# Altium project ISPR_DEOP.PrjPcb
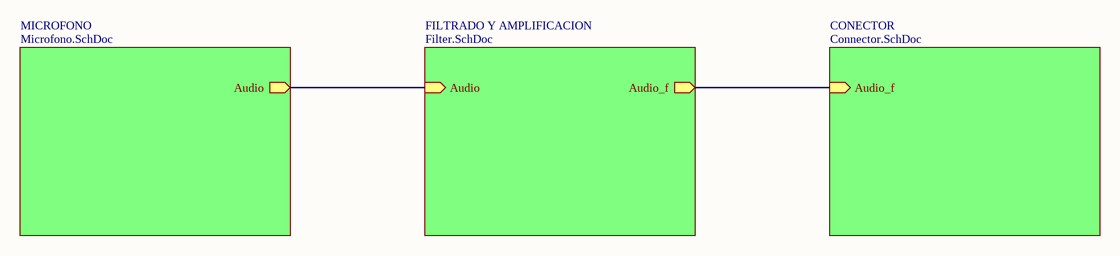
[diagram p0: Main.SchDoc]
3 sheets, 27 parts. Net scope: hierarchical (ports join the sheet entries above them; power ports are global).
Sheets:
  Main.SchDoc
    MICROFONO = Microfono.SchDoc
    FILTRADO Y AMPLIFICACION = Filter.SchDoc

## Sheet Main.SchDoc: PCB_Microfono
size A4; Author: Jose Luis Llorente González; CompanyName: ETSIT; Organization: UPM; Revision: V1.0

### Sub-sheets
CONECTOR = Connector.SchDoc (file not in this document): Audio_f (in)
FILTRADO Y AMPLIFICACION = Filter.SchDoc: Audio (in), Audio_f (out)
MICROFONO = Microfono.SchDoc: Audio (out)

### Nets
Out_E2: sheet FILTRADO Y AMPLIFICACION/Audio_f, sheet CONECTOR/Audio_f
NetC7_1: sheet MICROFONO/Audio, sheet FILTRADO Y AMPLIFICACION/Audio

### Notes on the sheet
- Title
- Size:
- Date:
- A4
- Number:
- Time:
- Revision:
- Sheet
- of
- File:

## Sheet Microfono.SchDoc: Microfono
size A4; Author: Jose Luis Llorente Gonzalez; CompanyName: ETSIT; Organization: UPM; Revision: V1.0
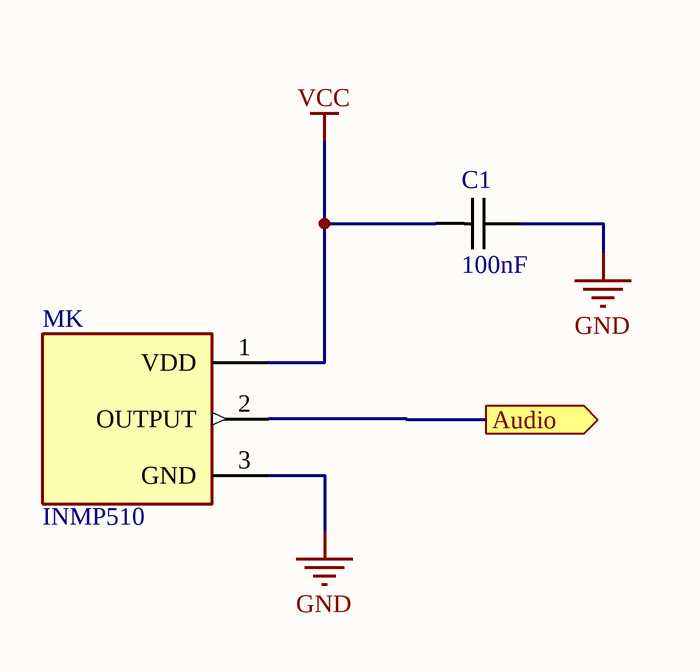
[diagram p1: Microfono.SchDoc]

### Parts
C1  100nF  [0805C-TBD]
MK  INMP510  [XDCR_INMP510]

### Ports
Audio (out)

### Nets
GND: C1.2 MK.3(GND)
VCC: C1.1 MK.1(VDD)
NetC7_1: MK.2(OUTPUT) ; port Audio

### Notes on the sheet
- Title
- Size:
- Date:
- A4
- Number:
- Time:
- Revision:
- Sheet
- of
- File:

### Library data of the parts
C1 = 0805C-100nF-25V-X7R-MUR: CAPACITOR 0805 CERAMIC; Supplier 1: Digi-Key; Supplier Part Number 1: 490-1673-1-ND
MK = INMP510: 60Hz ~ 20kHz Analog Microphone MEMS _Silicon_ 1.5V ~ 3.63V Omnidirectional _-38dB Â±2dB @ 94dB SPL_ Solder Pads; MF: TDK InvenSense; Value: *; MP: INMP510; SnapEDA_Link: https://www.snapeda.com/parts/INMP510/TDK%20InvenSense/view-part/2757133/?ref=snap; Package: LGA-3 TDK-InvenSense; Digi-Key_Part_Number: 1428-1016-2-ND; Digi-Key_Purchase_URL: https://www.digikey.com/product-detail/en/tdk-invensense/INMP510ACEZ-R7/1428-1016-2-ND/4311534?utm_source=snapeda&utm_medium=aggregator&utm_campaign=symbol

## Sheet Filter.SchDoc: Filter & amplification
size A4; Author: Jose Luis Llorente Gonzalez; CompanyName: ETSIT; Organization: UPM; Revision: V1.0
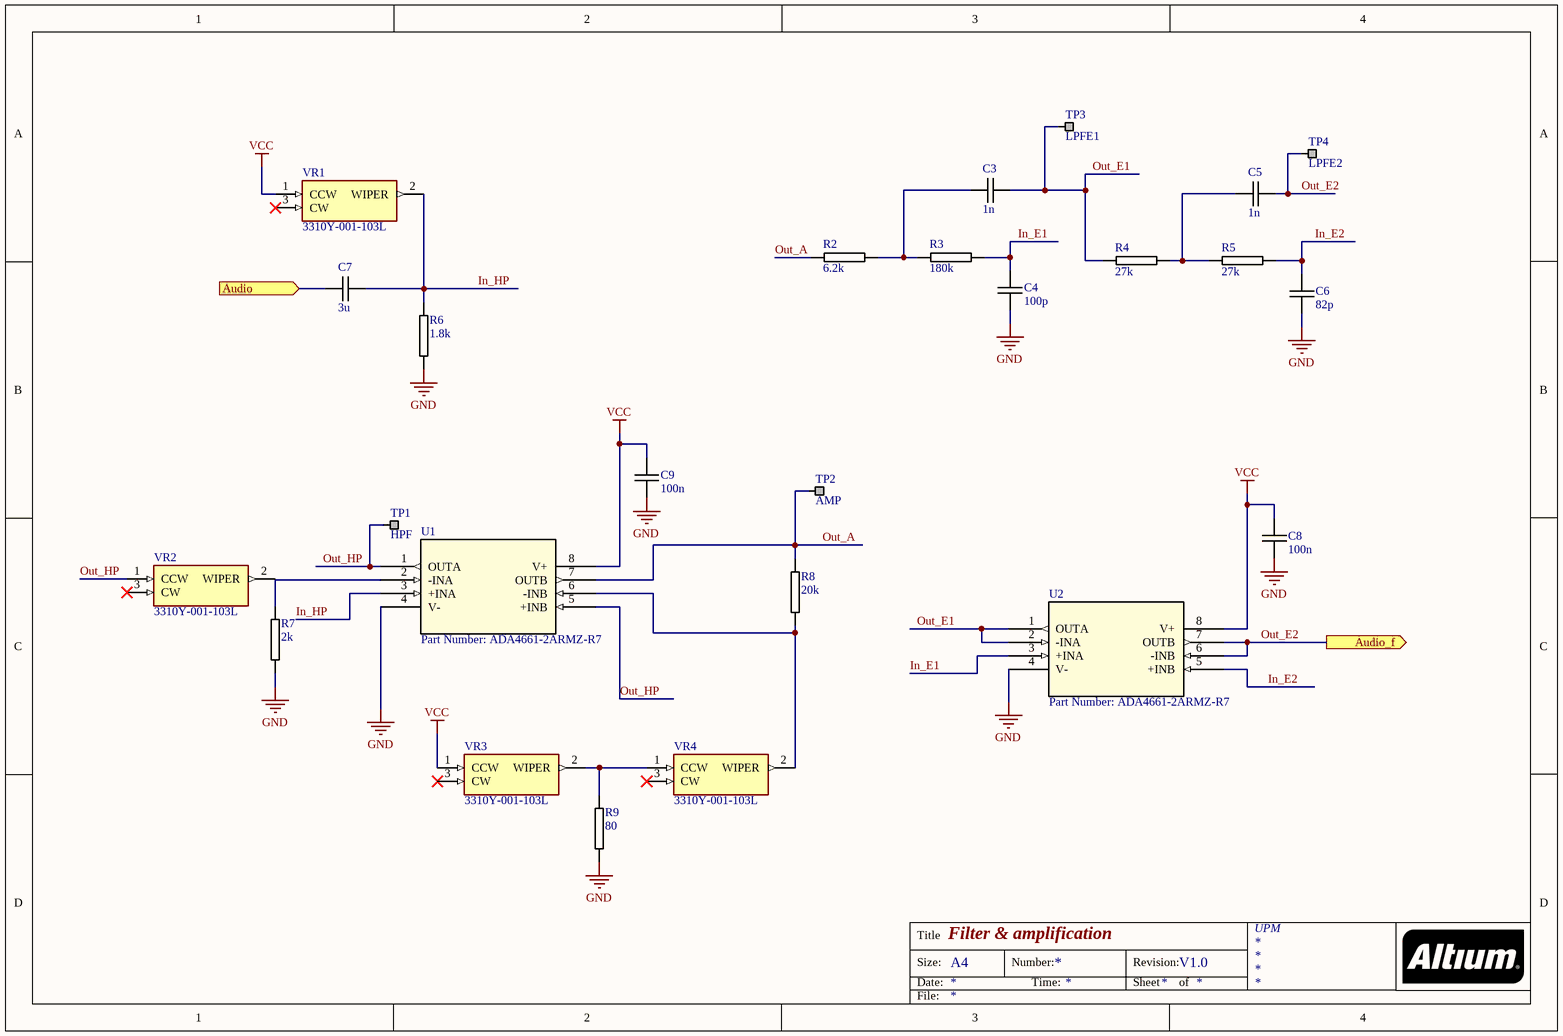
[diagram p2: Filter.SchDoc]

### Parts
C3  1n  [0805C-GENERIC]
C4  100p  [0805C-GENERIC]
C5  1n  [0805C-GENERIC]
C6  82p  [0805C-GENERIC]
C7  3u  [0805C-GENERIC]
C8  100n  [0805C-GENERIC]
C9  100n  [0805C-GENERIC]
R2  6.2k  [0805R-GENERIC]
R3  180k  [0805R-GENERIC]
R4  27k  [0805R-GENERIC]
R5  27k  [0805R-GENERIC]
R6  1.8k  [0805R-GENERIC]
R7  2k  [0805R-GENERIC]
R8  20k  [0805R-GENERIC]
R9  80  [0805R-GENERIC]
TP1  HPF  [TESTPIN]
TP2  AMP  [TESTPIN]
TP3  LPFE1  [TESTPIN]
TP4  LPFE2  [TESTPIN]
U1  Part Number: ADA4661-2ARMZ-R7  [RM_8]
U2  Part Number: ADA4661-2ARMZ-R7  [RM_8]
VR1  3310Y-001-103L  [3310Y-001]
VR2  3310Y-001-103L  [3310Y-001]
VR3  3310Y-001-103L  [3310Y-001]
VR4  3310Y-001-103L  [3310Y-001]

### Ports
Audio (in), Audio_f (out)

### Nets
GND: C4.1 C6.1 C8.2 C9.2 R6.2 R7.2 R9.2 U1.4(V-) U2.4(V-)
VCC: C8.1 C9.1 U1.8(V+) U2.8(V+) VR1.1(CCW) VR3.1(CCW)
In_E1: C4.2 R3.2 U2.3(+INA)
In_E2: C6.2 R5.2 U2.5(+INB)
In_HP: C7.2 R6.1 U1.3(+INA) VR1.2(WIPER)
Out_A: R2.1 R8.1 TP2.1 U1.7(OUTB)
Out_E1: C3.2 R4.1 TP3.1 U2.1(OUTA) U2.2(-INA)
Out_E2: C5.2 TP4.1 U2.6(-INB) U2.7(OUTB) ; port Audio_f
Out_HP: TP1.1 U1.1(OUTA) U1.5(+INB) VR2.1(CCW)
NetC3_1: C3.1 R2.2 R3.1
NetC5_1: C5.1 R4.2 R5.1
NetC7_1: C7.1 ; port Audio
NetR7_1: R7.1 U1.2(-INA)
NetR8_2: R8.2 U1.6(-INB) VR4.2(WIPER)
NetR9_1: R9.1 VR3.2(WIPER) VR4.1(CCW)

Not connected (* = marked no-connect by the designer): VR1 3(CW)*; VR2 2(WIPER) 3(CW)*; VR3 3(CW)*; VR4 3(CW)*

### Notes on the sheet
- Title
- Size:
- Date:
- A4
- Number:
- Time:
- Revision:
- Sheet
- of
- File:

### Library data of the parts
C3-C9 = C0805-GENERIC: GENERIC CAPACITOR NON POLARISED0603
R2-R9 = R0805-GENERIC: GENERIC RESISTOR 0805
TP1-TP4 = TESTPIN: TESTPIN SINGLE PIN HEADER; Manufacturer 1: Sharon Long Industries; Manufacturer Part Number 1: Cut-it-yourself; Reel: TH; Supplier 1: Sharon Long Industries; Supplier 1 Part number: Cut-It-Yourself
U1 U2 = ADA4661-2ARMZ-R7: No Description Available; Built_By: EMA_Christopher; Vendor: Analog Devices Inc; Copyright: Copyright (C) 2016 Accelerated Designs. All rights reserved; Manufacturer_Part_Number: ADA4661-2ARMZ-R7; RefDes: RefDes; Type: DEV; Value: Value
VR1-VR4 = 3310Y-001-103L: Variable Resistor; Manufacturer_Name: Bourns; Datasheet Link: http://www.bourns.com/docs/Product-Datasheets/3310.pdf; Manufacturer_Part_Number: 3310Y-001-103L; Mouser Part Number: 652-3310Y-001-103L; Mouser Price/Stock: https://www.mouser.com/Search/Refine.aspx?Keyword=652-3310Y-001-103L; RS Part Number: 5220625P; RS Price/Stock: http://uk.rs-online.com/web/p/products/5220625P

## Nets that join several sheets
GND: Microfono (C1.2 MK.3), Filter (9 pins)
VCC: Microfono (C1.1 MK.1), Filter (6 pins)
NetC7_1: Microfono (MK.2), Filter (C7.1)